# Altium project TempCtrlBoard.PrjPcb
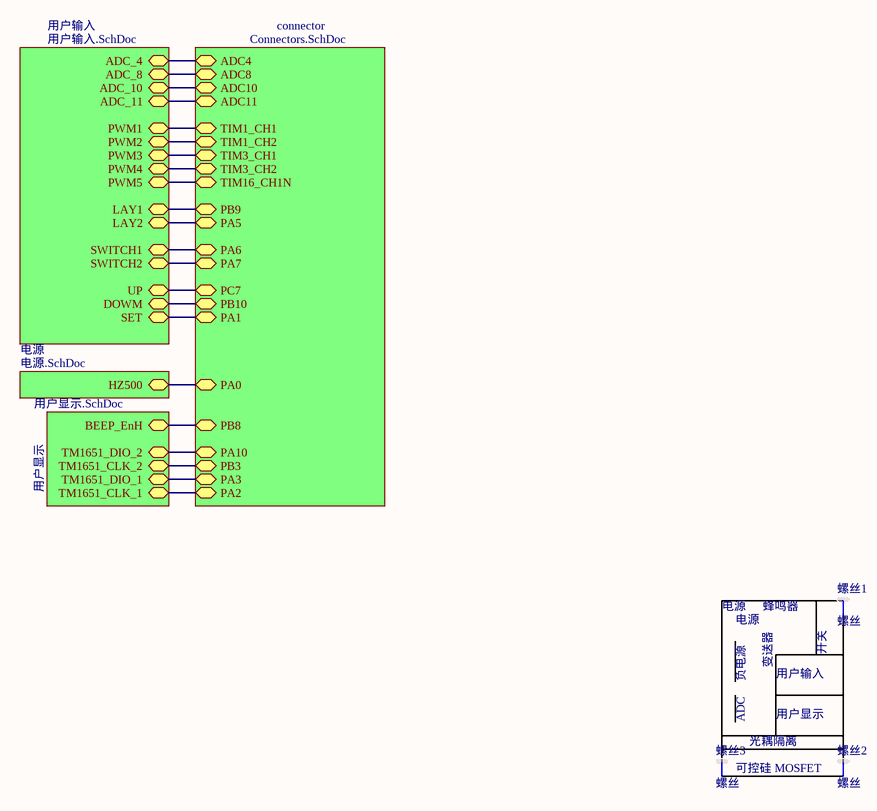
[diagram p0: main.SchDoc]
2 sheets, 7 parts. Net scope: hierarchical (ports join the sheet entries above them; power ports are global).
Board file: TempCtrlBoard.PcbDoc
Sheets:
  main.SchDoc
    connector = Connectors.SchDoc

## Sheet main.SchDoc
size A4

### Parts
螺丝1  螺丝  [M3_empty]
螺丝2  螺丝  [M3_empty]
螺丝3  螺丝  [M3_empty]

### Sub-sheets
connector = Connectors.SchDoc: ADC8 (bidir), ADC4 (bidir), ADC10 (bidir), ADC11 (bidir), TIM1_CH2, TIM3_CH2, TIM3_CH1, TIM1_CH1, PA2, PA3, PB3, PA10, PB10, PC7, PA0 (bidir), PB8, PB9, PA6, PA5, PA7, TIM16_CH1N, PA1
用户显示 = 用户显示.SchDoc (file not in this document): TM1651_CLK_1, TM1651_CLK_2, TM1651_DIO_1, TM1651_DIO_2, BEEP_EnH
用户输入 = 用户输入.SchDoc (file not in this document): UP, DOWM, SET, PWM1, PWM2, ADC_4, ADC_11, ADC_8, ADC_10, PWM4, PWM3, LAY2, SWITCH2, SWITCH1, LAY1, PWM5
电源 = 电源.SchDoc (file not in this document): HZ500

### Nets
ADC4: sheet 用户输入/ADC_4, sheet connector/ADC4
ADC8: sheet 用户输入/ADC_8, sheet connector/ADC8
ADC10: sheet 用户输入/ADC_10, sheet connector/ADC10
ADC11: sheet 用户输入/ADC_11, sheet connector/ADC11
HZ_1: sheet 用户输入/PWM4, sheet connector/TIM3_CH2
HZ_2: sheet 用户输入/PWM2, sheet connector/TIM1_CH2
PA0: sheet connector/PA0, sheet 电源/HZ500
PA1: sheet 用户输入/SET, sheet connector/PA1
PA2: sheet 用户显示/TM1651_CLK_1, sheet connector/PA2
PA3: sheet 用户显示/TM1651_DIO_1, sheet connector/PA3
PA5: sheet 用户输入/LAY2, sheet connector/PA5
PA6: sheet 用户输入/SWITCH1, sheet connector/PA6
PA7: sheet 用户输入/SWITCH2, sheet connector/PA7
PA10: sheet 用户显示/TM1651_DIO_2, sheet connector/PA10
PB3: sheet 用户显示/TM1651_CLK_2, sheet connector/PB3
PB8: sheet 用户显示/BEEP_EnH, sheet connector/PB8
PB9: sheet 用户输入/LAY1, sheet connector/PB9
PB10: sheet 用户输入/DOWM, sheet connector/PB10
PC7: sheet 用户输入/UP, sheet connector/PC7
TIM1_CH1: sheet 用户输入/PWM1, sheet connector/TIM1_CH1
TIM3_CH1: sheet 用户输入/PWM3, sheet connector/TIM3_CH1
TIM16_CH1N: sheet 用户输入/PWM5, sheet connector/TIM16_CH1N

### Notes on the sheet
- 电源
- 蜂鸣器
- 负电源
- 用户输入
- 变送器
- (near 螺丝1) 开关
- (near 螺丝3) 可控硅 MOSFET
- ADC
- (near 螺丝3) 光耦隔离
- 用户显示

## Sheet Connectors.SchDoc: Extension connectors
size A4; DocumentNumber: MB1136; Revision: C.3; SheetNumber: 4; SheetTotal: 4; Project: NUCLEO-XXXXRX
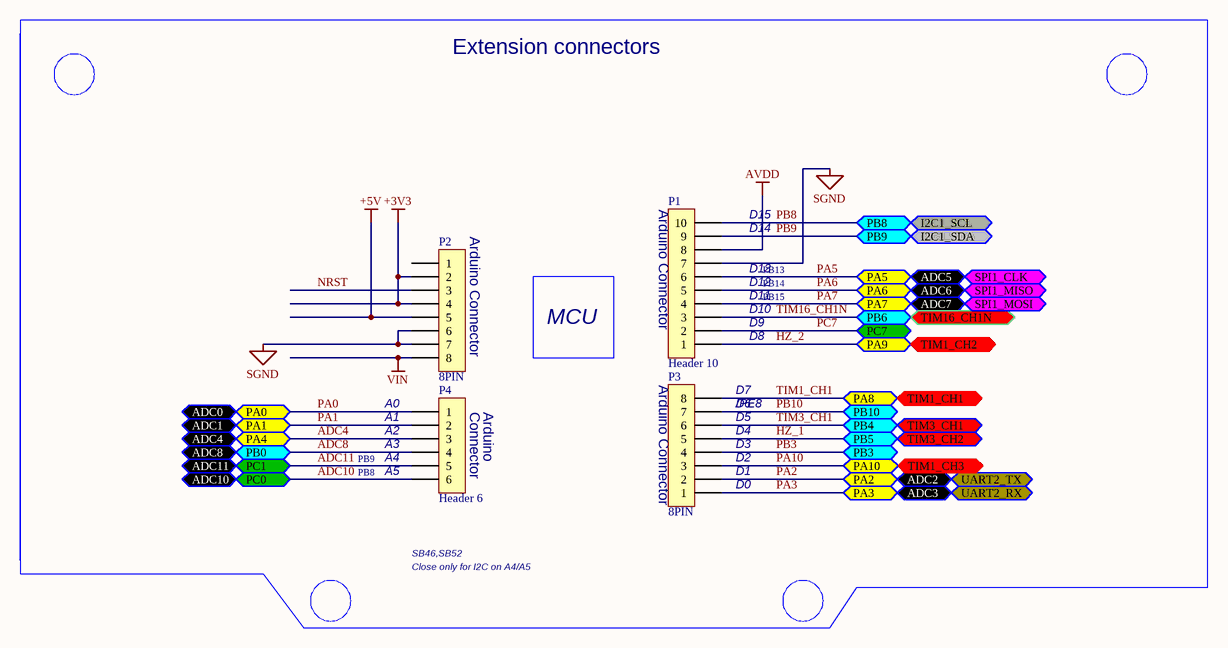
[diagram p1: Connectors.SchDoc]

### Parts
P1  Header 10  [CON10-P2.54]
P2  8PIN  [CON8-P2.54]
P3  8PIN  [CON8-P2.54]
P4  Header 6  [CON6-P2.54]

### Ports
ADC0 (bidir), ADC1 (bidir), ADC2 (bidir), ADC3 (bidir), ADC4 (bidir), ADC5 (bidir), ADC6 (bidir), ADC7 (bidir), ADC8 (bidir), ADC10 (bidir), ADC11 (bidir), I2C1_SCL (bidir), I2C1_SDA (bidir), PA0 (bidir), PA1, PA2, PA3, PA4, PA5, PA6, PA7, PA8, PA9, PA10, PB0, PB3, PB4, PB5, PB6, PB8, PB9, PB10, PC0, PC1, PC7, SPI1_CLK (bidir), SPI1_MISO (bidir), SPI1_MOSI (bidir), TIM1_CH1, TIM1_CH2, TIM1_CH3, TIM3_CH1, TIM3_CH2, TIM16_CH1N, UART2_RX (bidir), UART2_TX (bidir)

### Nets
+3V3: P2.2 P2.4
+5V: P2.5
AVDD: P1.8
SGND: P1.7 P2.6 P2.7
VIN: P2.8
ADC4: P4.3 ; port PA4, port ADC4
ADC8: P4.4 ; port PB0, port ADC8
ADC10: P4.6 ; port PC0, port ADC10
ADC11: P4.5 ; port PC1, port ADC11
HZ_1: P3.5 ; port PB5, port TIM3_CH2
HZ_2: P1.1 ; port PA9, port TIM1_CH2
NRST: P2.3
PA0: P4.1 ; port PA0, port ADC0
PA1: P4.2 ; port PA1, port ADC1
PA2: P3.2 ; port PA2, port ADC2, port UART2_TX
PA3: P3.1 ; port PA3, port ADC3, port UART2_RX
PA5: P1.6 ; port PA5, port ADC5, port SPI1_CLK
PA6: P1.5 ; port PA6, port ADC6, port SPI1_MISO
PA7: P1.4 ; port PA7, port ADC7, port SPI1_MOSI
PA10: P3.3 ; port PA10, port TIM1_CH3
PB3: P3.4 ; port PB3
PB8: P1.10 ; port PB8, port I2C1_SCL
PB9: P1.9 ; port PB9, port I2C1_SDA
PB10: P3.7 ; port PB10
PC7: P1.2 ; port PC7
TIM1_CH1: P3.8 ; port PA8, port TIM1_CH1
TIM3_CH1: P3.6 ; port PB4, port TIM3_CH1
TIM16_CH1N: P1.3 ; port PB6, port TIM16_CH1N

Not connected (* = marked no-connect by the designer): P2 1

### Notes on the sheet
- Extension connectors
- (near P2) Arduino Connector
- (near P1) Arduino Connector
- (near P1) D14
- (near P1) D15
- (near P1) D10
- (near P1) D13
- (near P1) D12
- (near P1) D11
- PB13
- PB14
- PB15
- MCU
- (near P3) Arduino Connector
- (near P1) D8
- (near P1) D9
- A0
- (near P4) A1
- (near P4) A2
- (near P4) A3
- (near P4) Connector
- (near P4) Arduino
- (near P3) D4
- (near P3) D3
- (near P3) D5
- (near P3) D6
- (near P3) D7
- (near P3) /PE8
- PB9
- PB8
- (near P4) A4
- (near P4) A5
- (near P3) D0
- (near P3) D1
- (near P3) D2
- Close only for I2C on A4/A5
- SB46,SB52
- Title:
- Project:
- Size:
- Date:
- Reference:
- Sheet:
- Revision:
- of

### Library data of the parts
P1 = Header 10: Header, 10-Pin; LatestRevisionDate: 17-Jul-2002; LatestRevisionNote: Re-released for DXP Platform.; Publisher: Altium Limited
P2 P3 = Header 8: 连接器; specification: pitch3.96mm VH; LatestRevisionDate: 17-Jul-2002; LatestRevisionNote: Re-released for DXP Platform.; Publisher: Altium Limited; Value: 8PIN
P4 = Header 6: 连接器; Value: 6Pin,; LatestRevisionDate: 17-Jul-2002; LatestRevisionNote: Re-released for DXP Platform.; Publisher: Altium Limited